# Altium schematic sheet 05_Taxi_Toplight.SchDoc: Taxi_Toplight
size A4; DrawnBy: YILDIRIM_DOGRU
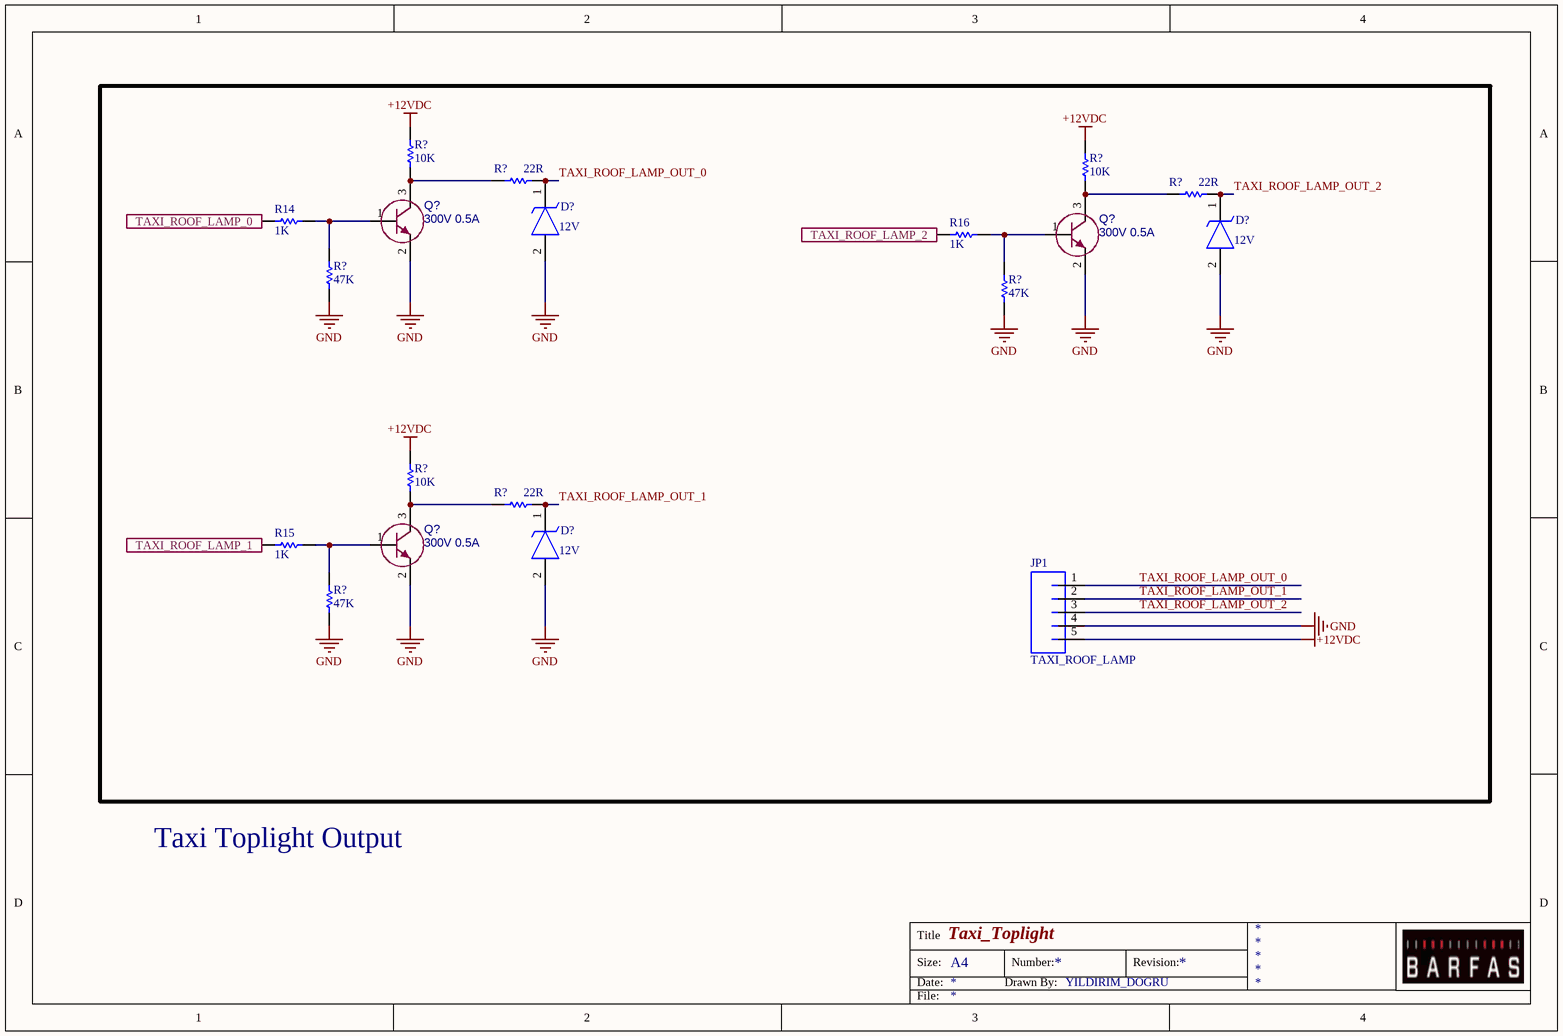
[diagram p0: 05_Taxi_Toplight.SchDoc]

## Parts
(Parts that share a designator on the sheet are numbered #1, #2 ... from top to bottom, then left to right.)
D?#1  value 12V  [DIOM5436X244N]  (hidden comment: SMBJ12A)
D?#2  value 12V  [DIOM5436X244N]  (hidden comment: SMBJ12A)
D?#3  value 12V  [DIOM5436X244N]  (hidden comment: SMBJ12A)
JP1  TAXI_ROOF_LAMP  [JST-XH-5-PTH-VERT]
Q?#1  value 300V 0.5A  [SOT-23-3]  (hidden comment: MMBTA42_R1_00001)
Q?#2  value 300V 0.5A  [SOT-23-3]  (hidden comment: MMBTA42_R1_00001)
Q?#3  value 300V 0.5A  [SOT-23-3]  (hidden comment: MMBTA42_R1_00001)
R14  value 1K  [RES_0603]  (hidden comment: 0603SAF1001T5E)
R15  value 1K  [RES_0603]  (hidden comment: 0603SAF1001T5E)
R16  value 1K  [RES_0603]  (hidden comment: 0603SAF1001T5E)
R?#1  value 10K  [RES_0402]  (hidden comment: RC0402JR-0710KL)
R?#2  value 10K  [RES_0402]  (hidden comment: RC0402JR-0710KL)
R?#3  value 22R  [RES_0603]  (hidden comment: 0603SAJ0220T5E)
R?#4  value 22R  [RES_0603]  (hidden comment: 0603SAJ0220T5E)
R?#5  value 47K  [RES_0603]  (hidden comment: 0603SAF4702T5E)
R?#6  value 47K  [RES_0603]  (hidden comment: 0603SAF4702T5E)
R?#7  value 10K  [RES_0402]  (hidden comment: RC0402JR-0710KL)
R?#8  value 22R  [RES_0603]  (hidden comment: 0603SAJ0220T5E)
R?#9  value 47K  [RES_0603]  (hidden comment: 0603SAF4702T5E)

## Ports
TAXI_ROOF_LAMP_0 (in), TAXI_ROOF_LAMP_1 (in), TAXI_ROOF_LAMP_2 (in)

## Nets
+12VDC: JP1.5 R?#1.1 R?#2.1 R?#7.1
GND: D?#1.2(A) D?#2.2(A) D?#3.2(A) JP1.4 Q?#1.2(E) Q?#2.2(E) Q?#3.2(E) R?#5.1 R?#6.1 R?#9.1
TAXI_ROOF_LAMP_0: R14.2 ; port TAXI_ROOF_LAMP_0
TAXI_ROOF_LAMP_1: R15.2 ; port TAXI_ROOF_LAMP_1
TAXI_ROOF_LAMP_2: R16.2 ; port TAXI_ROOF_LAMP_2
TAXI_ROOF_LAMP_OUT_0: D?#1.1(K) JP1.1 R?#3.2
TAXI_ROOF_LAMP_OUT_1: D?#3.1(K) JP1.2 R?#8.2
TAXI_ROOF_LAMP_OUT_2: D?#2.1(K) JP1.3 R?#4.2
NetQ?#1_1: Q?#1.1(B) R14.1 R?#5.2
NetQ?#1_3: Q?#1.3(C) R?#1.2 R?#3.1
NetQ?#2_1: Q?#2.1(B) R16.1 R?#6.2
NetQ?#2_3: Q?#2.3(C) R?#2.2 R?#4.1
NetQ?#3_1: Q?#3.1(B) R15.1 R?#9.2
NetQ?#3_3: Q?#3.3(C) R?#7.2 R?#8.1

## Notes on the sheet
- Taxi Toplight Output
- Title
- Size:
- Date:
- A4
- Drawn By:
- Number:
- Revision:
- File:

## Library data of the parts
D?#1-D?#3 = SMBJ12A: TVS, UNI-DIR, 600W, 12V, DO-214A; Manufacturer: Good-Ark Semiconductor; Manufacturer Part Number: SMBJ12A
JP1 = JST_XH_5_VERT: Manufacturer: JST Sales America, Inc.; PartNumber: B5B-XH-A(LF)(SN); Mounting Technology: Through Hole; PackageReference: JST-XH
Q?#1-Q?#3 = MMBTA42_R1_00001: TRANSISTOR DIS.500mA 300V NPN SOT23 GEN. SMT; Manufacturer: PANJIT; Package: SOT23; Supplier Part Number 1: 3757-MMBTA42_R1_00001CT-ND; Supplier Part Number 2: *; Supplier Part Number 3: MMBTA42_R1_00001; Supplier 1: DIGIKEY; Supplier 2: MOUSER; Supplier 3: OZDISAN; Manufacturer Part Number: MMBTA42_R1_00001
R14-R16 = 0603SAF1001T5E: RES.(1608) 0603 1K Ohms 1% 1/10W-S 100PPM; Manufacturer: ROYALOHM; Supplier 1: Ozdisan; Manufacturer Part Number: 0603SAF1001T5E
R?#1 R?#2 R?#7 = R03000: RES.(1005) 0402 10K Ohms 5% 1/16W 100PPM SMT; Manufacturer: YAGEO; Manufacturer Part Number: RC0402JR-0710KL
R?#3 R?#4 R?#8 = 0603SAJ0220T5E: RES.(1608) 0603 22 Ohms 5% 1/10W-S 200PPM; Manufacturer: ROYALOHM; Supplier 1: Ozdisan; Manufacturer Part Number: 0603SAJ0220T5E
R?#5 R?#6 R?#9 = 0603SAF4702T5E: RES.(1608) 0603 47K Ohms 1% 1/10W-S 100PPM; Manufacturer: ROYALOHM; Supplier 1: Ozdisan; Manufacturer Part Number: 0603SAF4702T5E